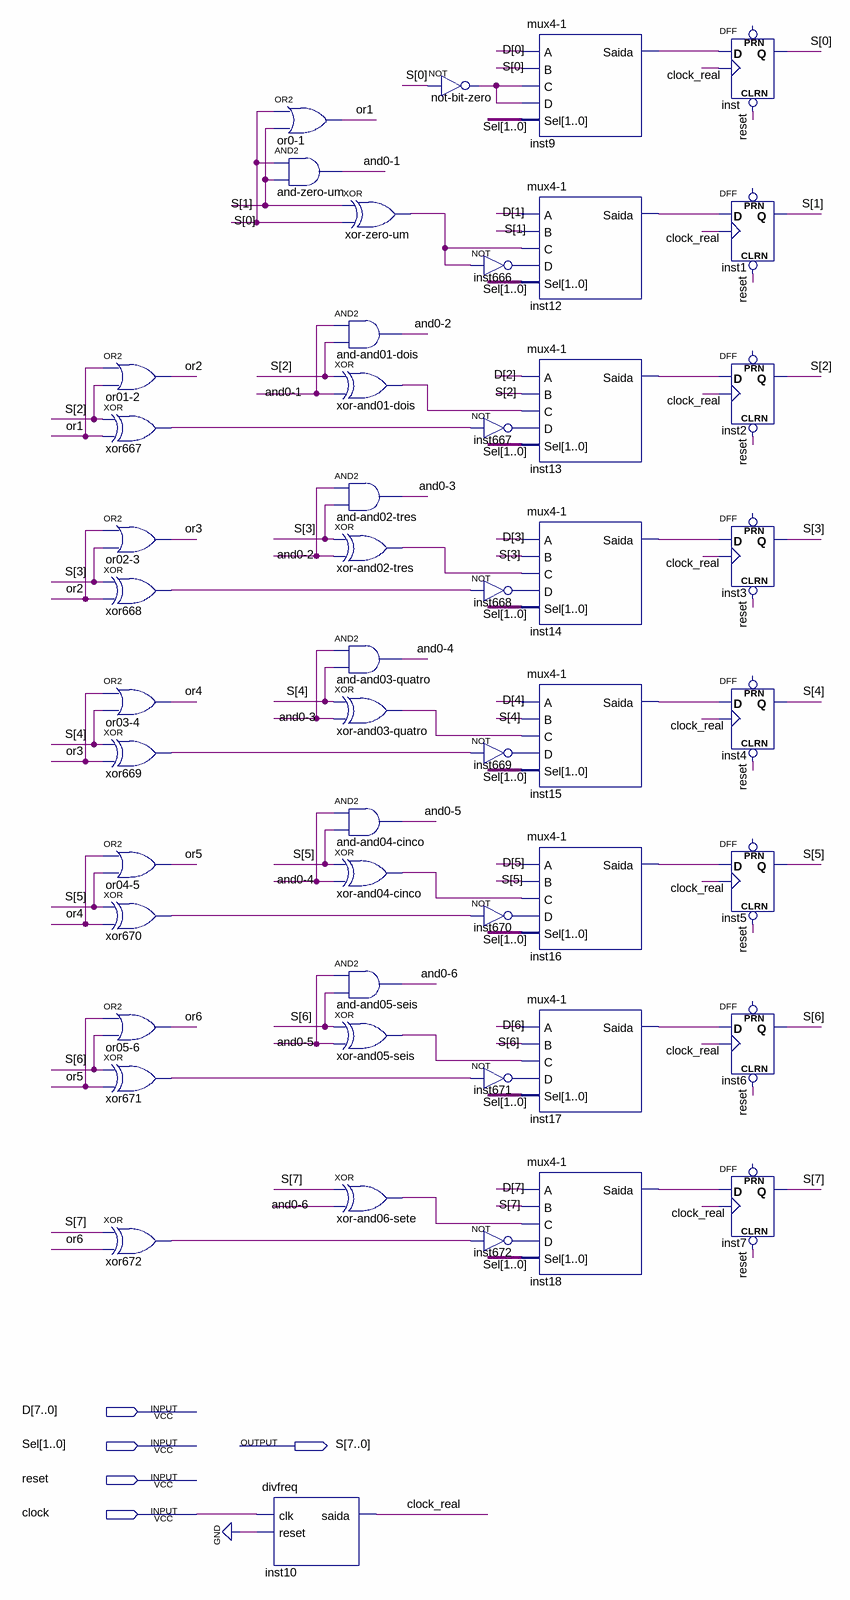
[diagram p0: schematic sheet]
// Quartus schematic contador-sincrono-up-down.bdf as structural Verilog: 50 symbols, 5 pins
module \contador-sincrono-up-down  (
  input  [7:0] D,
  input  [1:0] Sel,
  input  reset,
  input  clock,
  output [7:0] S
);

  wire \and0-1 , \and0-2 , \and0-3 , \and0-4 , \and0-5 , \and0-6 , clock_real, inst9_saida, inst12_saida,
       inst13_saida, inst14_saida, inst15_saida, inst16_saida, inst17_saida, inst18_saida, inst666_out,
       inst667_out, inst668_out, inst669_out, inst670_out, inst671_out, inst672_out, not_bit_zero_out, or1,
       or2, or3, or4, or5, or6, xor667_out, xor668_out, xor669_out, xor670_out, xor671_out, xor672_out,
       xor_and01_dois_out, xor_and02_tres_out, xor_and03_quatro_out, xor_and04_cinco_out, xor_and05_seis_out,
       xor_and06_sete_out, xor_zero_um_out;

  or \or01-2  (or2, or1, S[2]);
  xor xor667 (xor667_out, S[2], or1);
  or \or02-3  (or3, or2, S[3]);
  xor xor668 (xor668_out, S[3], or2);
  or \or03-4  (or4, or3, S[4]);
  xor xor669 (xor669_out, S[4], or3);
  or \or04-5  (or5, or4, S[5]);
  xor xor670 (xor670_out, S[5], or4);
  or \or05-6  (or6, or5, S[6]);
  xor xor671 (xor671_out, S[6], or5);
  xor xor672 (xor672_out, S[7], or6);
  or \or0-1  (or1, S[0], S[1]);
  and \and-zero-um  (\and0-1 , S[0], S[1]);
  divfreq inst10 (.clk(clock), .reset(1'b0), .saida(clock_real));
  xor \xor-zero-um  (xor_zero_um_out, S[1], S[0]);
  and \and-and01-dois  (\and0-2 , \and0-1 , S[2]);
  xor \xor-and01-dois  (xor_and01_dois_out, S[2], \and0-1 );
  and \and-and02-tres  (\and0-3 , \and0-2 , S[3]);
  xor \xor-and02-tres  (xor_and02_tres_out, S[3], \and0-2 );
  and \and-and03-quatro  (\and0-4 , \and0-3 , S[4]);
  xor \xor-and03-quatro  (xor_and03_quatro_out, S[4], \and0-3 );
  and \and-and04-cinco  (\and0-5 , \and0-4 , S[5]);
  xor \xor-and04-cinco  (xor_and04_cinco_out, S[5], \and0-4 );
  and \and-and05-seis  (\and0-6 , \and0-5 , S[6]);
  xor \xor-and05-seis  (xor_and05_seis_out, S[6], \and0-5 );
  xor \xor-and06-sete  (xor_and06_sete_out, S[7], \and0-6 );
  not \not-bit-zero  (not_bit_zero_out, S[0]);
  not inst666 (inst666_out, xor_zero_um_out);
  not inst667 (inst667_out, xor667_out);
  not inst668 (inst668_out, xor668_out);
  not inst669 (inst669_out, xor669_out);
  not inst670 (inst670_out, xor670_out);
  not inst671 (inst671_out, xor671_out);
  not inst672 (inst672_out, xor672_out);
  \mux4-1  inst9 (.A(D[0]), .B(S[0]), .C(not_bit_zero_out), .D(not_bit_zero_out), .Sel(Sel), .Saida(inst9_saida));
  \mux4-1  inst12 (.A(D[1]), .B(S[1]), .C(xor_zero_um_out), .D(inst666_out), .Sel(Sel), .Saida(inst12_saida));
  \mux4-1  inst13 (.A(D[2]), .B(S[2]), .C(xor_and01_dois_out), .D(inst667_out), .Sel(Sel), .Saida(inst13_saida));
  \mux4-1  inst14 (.A(D[3]), .B(S[3]), .C(xor_and02_tres_out), .D(inst668_out), .Sel(Sel), .Saida(inst14_saida));
  \mux4-1  inst15 (.A(D[4]), .B(S[4]), .C(xor_and03_quatro_out), .D(inst669_out), .Sel(Sel), .Saida(inst15_saida));
  \mux4-1  inst16 (.A(D[5]), .B(S[5]), .C(xor_and04_cinco_out), .D(inst670_out), .Sel(Sel), .Saida(inst16_saida));
  \mux4-1  inst17 (.A(D[6]), .B(S[6]), .C(xor_and05_seis_out), .D(inst671_out), .Sel(Sel), .Saida(inst17_saida));
  \mux4-1  inst18 (.A(D[7]), .B(S[7]), .C(xor_and06_sete_out), .D(inst672_out), .Sel(Sel), .Saida(inst18_saida));
  DFF inst (.CLRN(reset), .CLK(clock_real), .D(inst9_saida), .Q(S[0]));  // open: PRN
  DFF inst1 (.CLRN(reset), .CLK(clock_real), .D(inst12_saida), .Q(S[1]));  // open: PRN
  DFF inst2 (.CLRN(reset), .CLK(clock_real), .D(inst13_saida), .Q(S[2]));  // open: PRN
  DFF inst3 (.CLRN(reset), .CLK(clock_real), .D(inst14_saida), .Q(S[3]));  // open: PRN
  DFF inst4 (.CLRN(reset), .CLK(clock_real), .D(inst15_saida), .Q(S[4]));  // open: PRN
  DFF inst5 (.CLRN(reset), .CLK(clock_real), .D(inst16_saida), .Q(S[5]));  // open: PRN
  DFF inst6 (.CLRN(reset), .CLK(clock_real), .D(inst17_saida), .Q(S[6]));  // open: PRN
  DFF inst7 (.CLRN(reset), .CLK(clock_real), .D(inst18_saida), .Q(S[7]));  // open: PRN
endmodule
